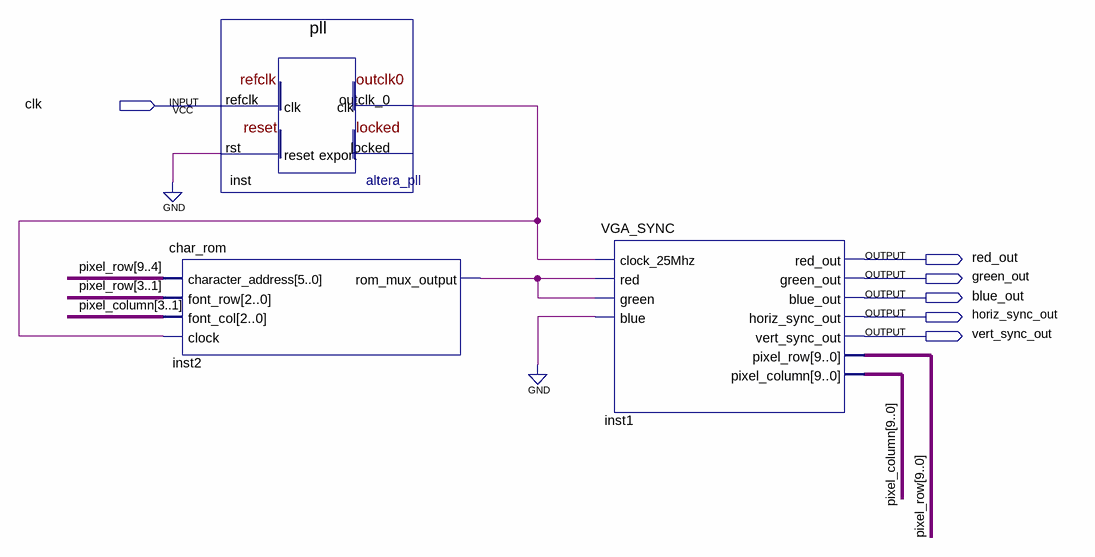
[diagram p0: schematic sheet]
// Quartus schematic Text.bdf as structural Verilog: 3 symbols, 6 pins
module Text (
  input  clk,
  output red_out,
  output green_out,
  output blue_out,
  output horiz_sync_out,
  output vert_sync_out
);

  wire inst2_rom_mux_output, inst_outclk_0;
  wire [9:0] pixel_column, pixel_row;

  char_rom inst2 (
    .character_address(pixel_row[9:4]), .font_row(pixel_row[3:1]), .font_col(pixel_column[3:1]),
    .clock(inst_outclk_0), .rom_mux_output(inst2_rom_mux_output));
  pll inst (.refclk(clk), .rst(1'b0), .outclk_0(inst_outclk_0));  // open: locked
  VGA_SYNC inst1 (
    .clock_25Mhz(inst_outclk_0), .red(inst2_rom_mux_output), .green(inst2_rom_mux_output), .blue(1'b0),
    .red_out(red_out), .green_out(green_out), .blue_out(blue_out), .horiz_sync_out(horiz_sync_out),
    .vert_sync_out(vert_sync_out), .pixel_row(pixel_row), .pixel_column(pixel_column));
endmodule
